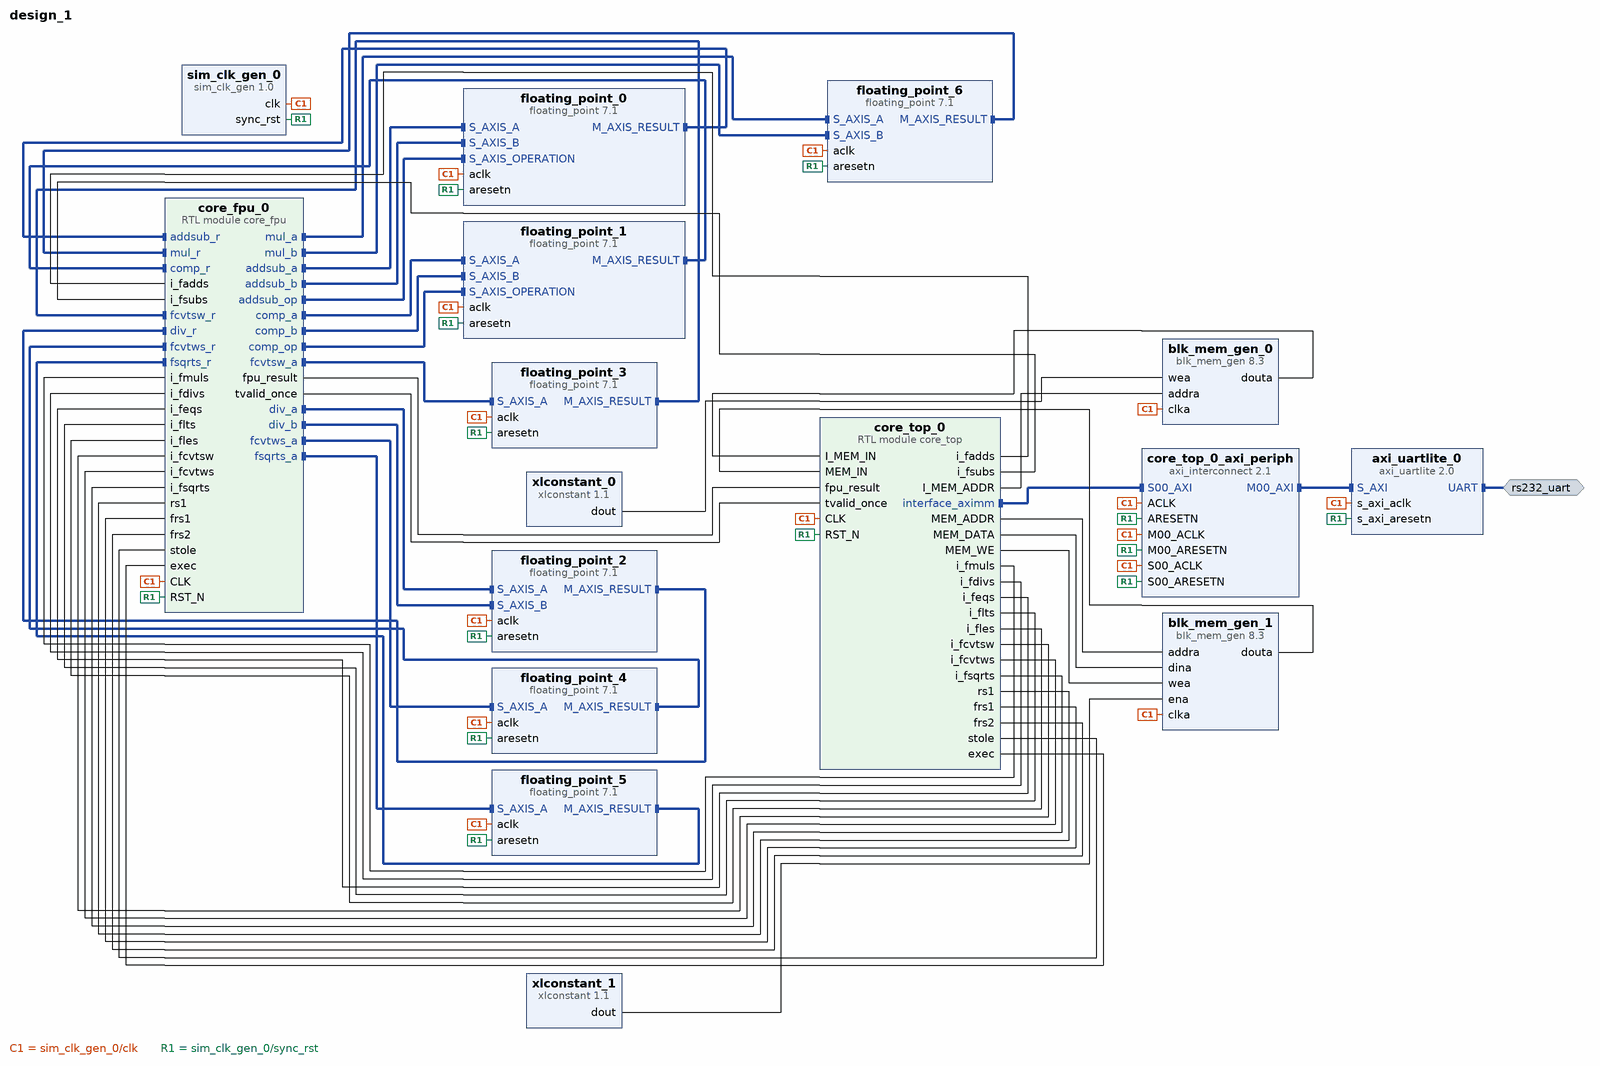
[diagram p0: block diagram of the top level]
# Vivado block design design_1, xcku040-ffva1156-2-e, Vivado 2016.4
create_bd_design design_1

create_bd_intf_port -mode Master -vlnv xilinx.com:interface:uart_rtl:1.0 rs232_uart

create_bd_cell -type ip -vlnv xilinx.com:ip:floating_point:7.1 floating_point_0
set_property -dict {CONFIG.Has_ARESETn true} [get_bd_cells floating_point_0]
create_bd_cell -type ip -vlnv xilinx.com:ip:floating_point:7.1 floating_point_1
set_property -dict [list \
  CONFIG.Operation_Type Compare \
  CONFIG.Result_Precision_Type Custom \
  CONFIG.C_Result_Exponent_Width 1 \
  CONFIG.C_Result_Fraction_Width 0 \
  CONFIG.C_Mult_Usage No_Usage \
  CONFIG.C_Latency 3 \
  CONFIG.C_Rate 1 \
  CONFIG.Has_ARESETn true \
] [get_bd_cells floating_point_1]
create_bd_cell -type ip -vlnv xilinx.com:ip:floating_point:7.1 floating_point_2
set_property -dict [list \
  CONFIG.Operation_Type Divide \
  CONFIG.Result_Precision_Type Single \
  CONFIG.C_Result_Exponent_Width 8 \
  CONFIG.C_Result_Fraction_Width 24 \
  CONFIG.C_Mult_Usage No_Usage \
  CONFIG.C_Latency 29 \
  CONFIG.C_Rate 1 \
  CONFIG.Has_ARESETn true \
] [get_bd_cells floating_point_2]
create_bd_cell -type ip -vlnv xilinx.com:ip:floating_point:7.1 floating_point_3
set_property -dict [list \
  CONFIG.Operation_Type Fixed_to_float \
  CONFIG.Result_Precision_Type Single \
  CONFIG.C_Result_Exponent_Width 8 \
  CONFIG.C_Result_Fraction_Width 24 \
  CONFIG.C_Accum_Msb 32 \
  CONFIG.C_Accum_Lsb -31 \
  CONFIG.C_Accum_Input_Msb 32 \
  CONFIG.C_Mult_Usage No_Usage \
  CONFIG.C_Latency 7 \
  CONFIG.C_Rate 1 \
  CONFIG.Has_ARESETn true \
] [get_bd_cells floating_point_3]
create_bd_cell -type ip -vlnv xilinx.com:ip:floating_point:7.1 floating_point_4
set_property -dict [list \
  CONFIG.Operation_Type Float_to_fixed \
  CONFIG.Result_Precision_Type Int32 \
  CONFIG.C_Result_Exponent_Width 32 \
  CONFIG.C_Result_Fraction_Width 0 \
  CONFIG.C_Accum_Msb 32 \
  CONFIG.C_Accum_Lsb -31 \
  CONFIG.C_Accum_Input_Msb 32 \
  CONFIG.C_Mult_Usage No_Usage \
  CONFIG.C_Latency 7 \
  CONFIG.C_Rate 1 \
  CONFIG.Has_ARESETn true \
] [get_bd_cells floating_point_4]
create_bd_cell -type ip -vlnv xilinx.com:ip:floating_point:7.1 floating_point_5
set_property -dict [list \
  CONFIG.Operation_Type Square_root \
  CONFIG.Result_Precision_Type Single \
  CONFIG.C_Result_Exponent_Width 8 \
  CONFIG.C_Result_Fraction_Width 24 \
  CONFIG.C_Accum_Msb 32 \
  CONFIG.C_Accum_Lsb -31 \
  CONFIG.C_Accum_Input_Msb 32 \
  CONFIG.C_Mult_Usage No_Usage \
  CONFIG.C_Latency 29 \
  CONFIG.C_Rate 1 \
  CONFIG.Has_ARESETn true \
] [get_bd_cells floating_point_5]
create_bd_cell -type ip -vlnv xilinx.com:ip:floating_point:7.1 floating_point_6
set_property -dict [list \
  CONFIG.Operation_Type Multiply \
  CONFIG.Result_Precision_Type Single \
  CONFIG.C_Result_Exponent_Width 8 \
  CONFIG.C_Result_Fraction_Width 24 \
  CONFIG.C_Accum_Msb 32 \
  CONFIG.C_Accum_Lsb -31 \
  CONFIG.C_Accum_Input_Msb 32 \
  CONFIG.C_Mult_Usage No_Usage \
  CONFIG.C_Latency 9 \
  CONFIG.C_Rate 1 \
  CONFIG.Has_ARESETn true \
] [get_bd_cells floating_point_6]
create_bd_cell -type ip -vlnv xilinx.com:ip:blk_mem_gen:8.3 blk_mem_gen_0
set_property -dict [list \
  CONFIG.Enable_32bit_Address false \
  CONFIG.Use_Byte_Write_Enable false \
  CONFIG.Enable_A Always_Enabled \
  CONFIG.Register_PortA_Output_of_Memory_Primitives true \
  CONFIG.Load_Init_File true \
  CONFIG.Coe_File ../../../../../../../simulator/test/test_f.coe \
  CONFIG.Fill_Remaining_Memory_Locations true \
  CONFIG.Use_RSTA_Pin false \
  CONFIG.use_bram_block Stand_Alone \
] [get_bd_cells blk_mem_gen_0]
create_bd_cell -type ip -vlnv xilinx.com:ip:xlconstant:1.1 xlconstant_0
set_property -dict {CONFIG.CONST_VAL 0} [get_bd_cells xlconstant_0]
create_bd_cell -type ip -vlnv xilinx.com:ip:blk_mem_gen:8.3 blk_mem_gen_1
set_property -dict [list \
  CONFIG.Enable_32bit_Address false \
  CONFIG.Use_Byte_Write_Enable false \
  CONFIG.Enable_A Use_ENA_Pin \
  CONFIG.Register_PortA_Output_of_Memory_Primitives true \
  CONFIG.Use_RSTA_Pin false \
  CONFIG.use_bram_block Stand_Alone \
] [get_bd_cells blk_mem_gen_1]
create_bd_cell -type ip -vlnv xilinx.com:ip:xlconstant:1.1 xlconstant_1
create_bd_cell -type ip -vlnv xilinx.com:ip:axi_uartlite:2.0 axi_uartlite_0
set_property -dict {CONFIG.USE_BOARD_FLOW true CONFIG.UARTLITE_BOARD_INTERFACE rs232_uart} [get_bd_cells axi_uartlite_0]
create_bd_cell -type ip -vlnv xilinx.com:ip:sim_clk_gen:1.0 sim_clk_gen_0
create_bd_cell -type ip -vlnv xilinx.com:ip:axi_interconnect:2.1 core_top_0_axi_periph
set_property -dict {CONFIG.NUM_MI 1} [get_bd_cells core_top_0_axi_periph]
create_bd_cell -type module -reference core_fpu core_fpu_0
create_bd_cell -type module -reference core_top core_top_0

# ---- connections ----

connect_bd_intf_net [get_bd_intf_pins floating_point_0/S_AXIS_A] [get_bd_intf_pins core_fpu_0/addsub_a]
connect_bd_intf_net [get_bd_intf_pins core_fpu_0/addsub_b] [get_bd_intf_pins floating_point_0/S_AXIS_B]
connect_bd_intf_net [get_bd_intf_pins floating_point_0/S_AXIS_OPERATION] [get_bd_intf_pins core_fpu_0/addsub_op]
connect_bd_intf_net [get_bd_intf_pins floating_point_0/M_AXIS_RESULT] [get_bd_intf_pins core_fpu_0/addsub_r]
connect_bd_intf_net [get_bd_intf_pins floating_point_1/S_AXIS_A] [get_bd_intf_pins core_fpu_0/comp_a]
connect_bd_intf_net [get_bd_intf_pins floating_point_1/S_AXIS_B] [get_bd_intf_pins core_fpu_0/comp_b]
connect_bd_intf_net [get_bd_intf_pins core_fpu_0/comp_op] [get_bd_intf_pins floating_point_1/S_AXIS_OPERATION]
connect_bd_intf_net [get_bd_intf_pins floating_point_1/M_AXIS_RESULT] [get_bd_intf_pins core_fpu_0/comp_r]
connect_bd_intf_net [get_bd_intf_pins floating_point_2/S_AXIS_A] [get_bd_intf_pins core_fpu_0/div_a]
connect_bd_intf_net [get_bd_intf_pins floating_point_2/S_AXIS_B] [get_bd_intf_pins core_fpu_0/div_b]
connect_bd_intf_net [get_bd_intf_pins floating_point_2/M_AXIS_RESULT] [get_bd_intf_pins core_fpu_0/div_r]
connect_bd_intf_net [get_bd_intf_pins floating_point_3/S_AXIS_A] [get_bd_intf_pins core_fpu_0/fcvtsw_a]
connect_bd_intf_net [get_bd_intf_pins floating_point_3/M_AXIS_RESULT] [get_bd_intf_pins core_fpu_0/fcvtsw_r]
connect_bd_intf_net [get_bd_intf_pins floating_point_4/S_AXIS_A] [get_bd_intf_pins core_fpu_0/fcvtws_a]
connect_bd_intf_net [get_bd_intf_pins floating_point_4/M_AXIS_RESULT] [get_bd_intf_pins core_fpu_0/fcvtws_r]
connect_bd_intf_net [get_bd_intf_pins floating_point_5/S_AXIS_A] [get_bd_intf_pins core_fpu_0/fsqrts_a]
connect_bd_intf_net [get_bd_intf_pins floating_point_5/M_AXIS_RESULT] [get_bd_intf_pins core_fpu_0/fsqrts_r]
connect_bd_intf_net [get_bd_intf_pins floating_point_6/S_AXIS_A] [get_bd_intf_pins core_fpu_0/mul_a]
connect_bd_intf_net [get_bd_intf_pins floating_point_6/S_AXIS_B] [get_bd_intf_pins core_fpu_0/mul_b]
connect_bd_intf_net [get_bd_intf_pins core_fpu_0/mul_r] [get_bd_intf_pins floating_point_6/M_AXIS_RESULT]
connect_bd_intf_net [get_bd_intf_pins core_top_0/interface_aximm] [get_bd_intf_pins core_top_0_axi_periph/S00_AXI]
connect_bd_intf_net [get_bd_intf_pins core_top_0_axi_periph/M00_AXI] [get_bd_intf_pins axi_uartlite_0/S_AXI]
connect_bd_intf_net [get_bd_intf_ports rs232_uart] [get_bd_intf_pins axi_uartlite_0/UART]
connect_bd_net [get_bd_pins core_top_0/i_fadds] [get_bd_pins core_fpu_0/i_fadds]
connect_bd_net [get_bd_pins core_top_0/i_fsubs] [get_bd_pins core_fpu_0/i_fsubs]
connect_bd_net [get_bd_pins core_top_0/i_fmuls] [get_bd_pins core_fpu_0/i_fmuls]
connect_bd_net [get_bd_pins core_top_0/i_fdivs] [get_bd_pins core_fpu_0/i_fdivs]
connect_bd_net [get_bd_pins core_top_0/i_feqs] [get_bd_pins core_fpu_0/i_feqs]
connect_bd_net [get_bd_pins core_top_0/i_flts] [get_bd_pins core_fpu_0/i_flts]
connect_bd_net [get_bd_pins core_top_0/i_fles] [get_bd_pins core_fpu_0/i_fles]
connect_bd_net [get_bd_pins core_top_0/i_fcvtsw] [get_bd_pins core_fpu_0/i_fcvtsw]
connect_bd_net [get_bd_pins core_top_0/i_fcvtws] [get_bd_pins core_fpu_0/i_fcvtws]
connect_bd_net [get_bd_pins core_top_0/i_fsqrts] [get_bd_pins core_fpu_0/i_fsqrts]
connect_bd_net [get_bd_pins core_top_0/rs1] [get_bd_pins core_fpu_0/rs1]
connect_bd_net [get_bd_pins core_top_0/frs1] [get_bd_pins core_fpu_0/frs1]
connect_bd_net [get_bd_pins core_top_0/frs2] [get_bd_pins core_fpu_0/frs2]
connect_bd_net [get_bd_pins core_top_0/I_MEM_ADDR] [get_bd_pins blk_mem_gen_0/addra]
connect_bd_net [get_bd_pins blk_mem_gen_0/douta] [get_bd_pins core_top_0/I_MEM_IN]
connect_bd_net [get_bd_pins xlconstant_0/dout] [get_bd_pins blk_mem_gen_0/wea]
connect_bd_net [get_bd_pins core_fpu_0/fpu_result] [get_bd_pins core_top_0/fpu_result]
connect_bd_net [get_bd_pins core_top_0/MEM_ADDR] [get_bd_pins blk_mem_gen_1/addra]
connect_bd_net [get_bd_pins core_top_0/MEM_DATA] [get_bd_pins blk_mem_gen_1/dina]
connect_bd_net [get_bd_pins blk_mem_gen_1/douta] [get_bd_pins core_top_0/MEM_IN]
connect_bd_net [get_bd_pins core_top_0/MEM_WE] [get_bd_pins blk_mem_gen_1/wea]
connect_bd_net [get_bd_pins xlconstant_1/dout] [get_bd_pins blk_mem_gen_1/ena]
connect_bd_net -net clk_wiz_0_clk_out1 [get_bd_pins sim_clk_gen_0/clk] \
  [get_bd_pins floating_point_2/aclk] [get_bd_pins floating_point_1/aclk] [get_bd_pins floating_point_0/aclk] \
  [get_bd_pins floating_point_6/aclk] [get_bd_pins floating_point_3/aclk] [get_bd_pins floating_point_4/aclk] \
  [get_bd_pins floating_point_5/aclk] [get_bd_pins blk_mem_gen_1/clka] [get_bd_pins blk_mem_gen_0/clka] \
  [get_bd_pins axi_uartlite_0/s_axi_aclk] [get_bd_pins core_fpu_0/CLK] [get_bd_pins core_top_0_axi_periph/S00_ACLK] \
  [get_bd_pins core_top_0_axi_periph/ACLK] [get_bd_pins core_top_0_axi_periph/M00_ACLK] [get_bd_pins core_top_0/CLK]
connect_bd_net -net clk_wiz_0_locked [get_bd_pins sim_clk_gen_0/sync_rst] \
  [get_bd_pins floating_point_2/aresetn] [get_bd_pins floating_point_1/aresetn] [get_bd_pins floating_point_0/aresetn] \
  [get_bd_pins floating_point_6/aresetn] [get_bd_pins floating_point_3/aresetn] [get_bd_pins floating_point_4/aresetn] \
  [get_bd_pins floating_point_5/aresetn] [get_bd_pins axi_uartlite_0/s_axi_aresetn] [get_bd_pins core_fpu_0/RST_N] \
  [get_bd_pins core_top_0_axi_periph/S00_ARESETN] [get_bd_pins core_top_0_axi_periph/ARESETN] \
  [get_bd_pins core_top_0_axi_periph/M00_ARESETN] [get_bd_pins core_top_0/RST_N]
connect_bd_net [get_bd_pins core_top_0/stole] [get_bd_pins core_fpu_0/stole]
connect_bd_net [get_bd_pins core_fpu_0/tvalid_once] [get_bd_pins core_top_0/tvalid_once]
connect_bd_net [get_bd_pins core_top_0/exec] [get_bd_pins core_fpu_0/exec]

validate_bd_design
save_bd_design
